# Altium schematic sheet Sheet2.SchDoc
size A4
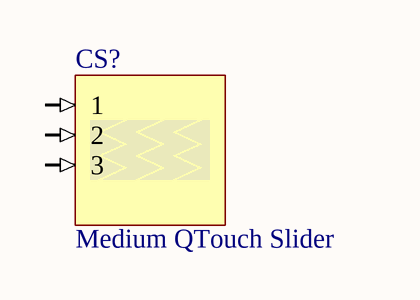
[diagram p0: Sheet2.SchDoc]

## Parts
CS?  Medium QTouch Slider  (no BOM)

## Nets

Not connected (* = marked no-connect by the designer): CS? 1 2 3

## Library data of the parts
CS? = MediumQTouchSlider: ConfiguratorName: ATMEL_TOUCH; ConfigurationParameters: {}__sensorid[4]{}width[50]{}height[20]{}gapthickness[0.4]{}